# Altium project C210 Rev_B_220601.PrjPcb (part 4 of 5)

## Sheet C210_0004_MAX_Module_220601.SchDoc: C210_0004_MAX_Module
size B; Date: 2/26/2021; CompanyName: U-blox; DrawnBy: EMOO; Engineer: EMOO; Organization: U-blox; Address1: 2601 25th St. SE; Address2: Salem, OR 97302; SheetNumber: 4; SheetTotal: 7; Website: www.u-blox.com; SheetSize: B; SheetTitle: C-210 MAX Module
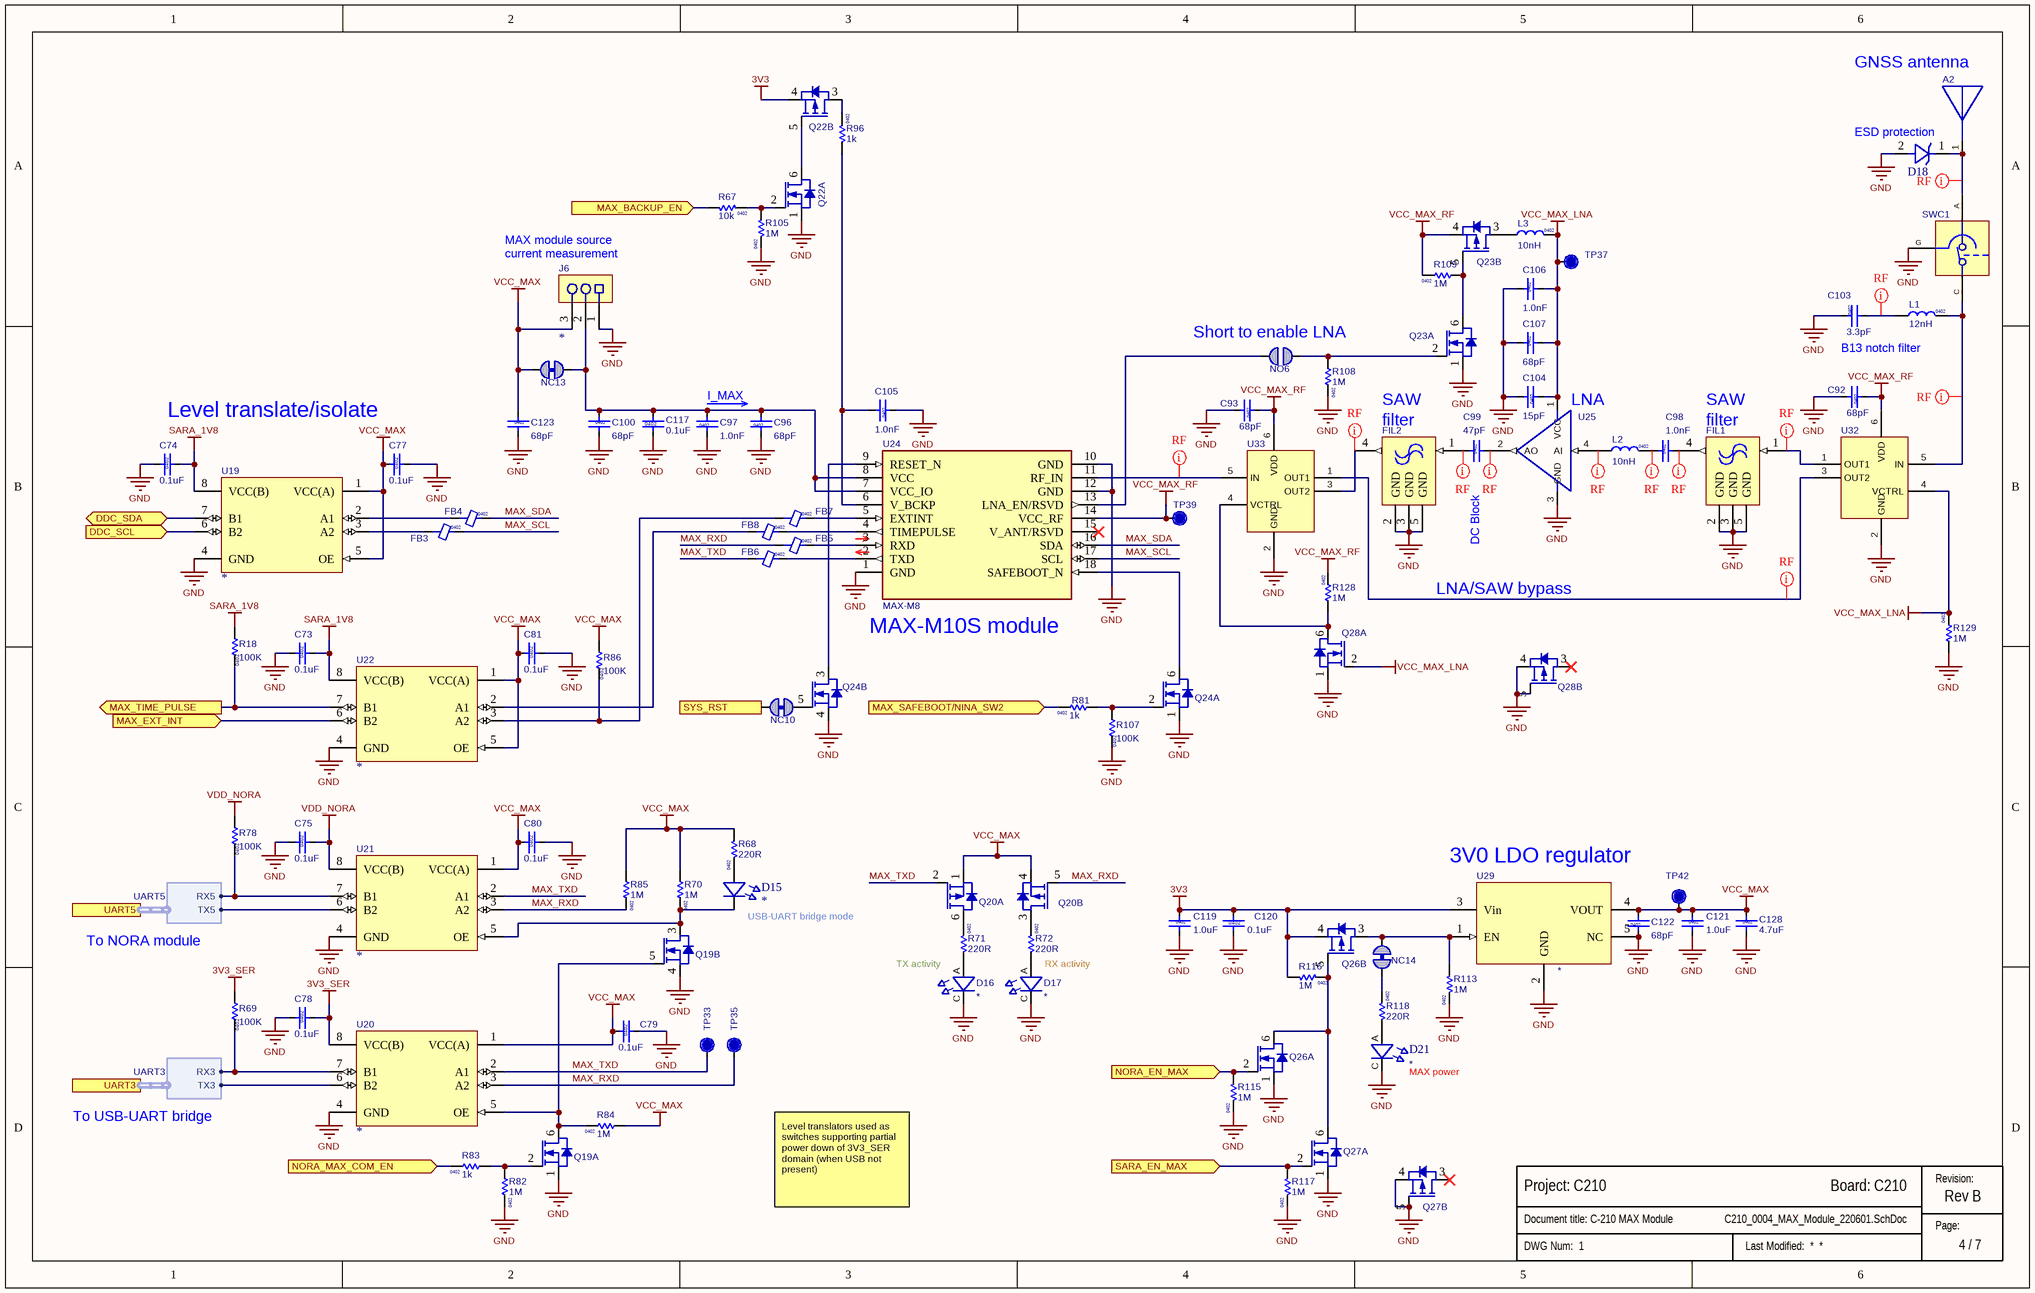
[diagram p6: C210_0004_MAX_Module_220601.SchDoc]

### Parts
(Parts that share a designator on the sheet are numbered #1, #2 ... from top to bottom, then left to right.)
?#8  (no value)  (graphical)
A2  CGGP.25.4.E.02  [CGGP.25.4.E.02]  (value not drawn)
C73  value 0.1uF  Size: 0402  [Cap 0402 HD]  (hidden comment: 120-000160.1uF)
C74  value 0.1uF  Size: 0402  [Cap 0402 HD]  (hidden comment: 120-000160.1uF)
C75  value 0.1uF  Size: 0402  [Cap 0402 HD]  (hidden comment: 120-000160.1uF)
C77  value 0.1uF  Size: 0402  [Cap 0402 HD]  (hidden comment: 120-000160.1uF)
C78  value 0.1uF  Size: 0402  [Cap 0402 HD]  (hidden comment: 120-000160.1uF)
C79  value 0.1uF  Size: 0402  [Cap 0402 HD]  (hidden comment: 120-000160.1uF)
C80  value 0.1uF  Size: 0402  [Cap 0402 HD]  (hidden comment: 120-000160.1uF)
C81  value 0.1uF  Size: 0402  [Cap 0402 HD]  (hidden comment: 120-000160.1uF)
C92  value 68pF  Size: 0402  [Cap 0402 HD]
C93  value 68pF  Size: 0402  [Cap 0402 HD]
C96  value 68pF  Size: 0402  [Cap 0402 HD]
C97  value 1.0nF  Size: 0402  [Cap 0402 HD]
C98  value 1.0nF  Size: 0402  [Cap 0402 HD]
C99  value 47pF  Size: 0402  [Cap 0402 HD]
C100  value 68pF  Size: 0402  [Cap 0402 HD]
C103  value 3.3pF  Size: 0402  [Cap 0402 HD]
C104  value 15pF  Size: 0402  [Cap 0402 HD]
C105  value 1.0nF  Size: 0402  [Cap 0402 HD]
C106  value 1.0nF  Size: 0402  [Cap 0402 HD]
C107  value 68pF  Size: 0402  [Cap 0402 HD]
C117  value 0.1uF  Size: 0402  [Cap 0402 HD]  (hidden comment: 120-000160.1uF)
C119  value 1.0uF  Size: 0402  [Cap 0402 HD]  (hidden comment: 120-000171.0uF)
C120  value 0.1uF  Size: 0402  [Cap 0402 HD]  (hidden comment: 120-000160.1uF)
C121  value 1.0uF  Size: 0402  [Cap 0402 HD]  (hidden comment: 120-000171.0uF)
C122  value 68pF  Size: 0402  [Cap 0402 HD]
C123  value 68pF  Size: 0402  [Cap 0402 HD]
C128  value 4.7uF  Size: 0402  [Cap 0402 HD]
D15  (no value)  [LED-0603]
D16  (no value)  [LTST-C190KGKT]
D17  (no value)  [LTST-C190YKT]
D18  (no value)  [SOD-923_2]
D21  (no value)  [LTST-C190EKT]
FB3  Size: 0402  [IND 0402]
FB4  Size: 0402  [IND 0402]
FB5  Size: 0402  [IND 0402]
FB6  Size: 0402  [IND 0402]
FB7  Size: 0402  [IND 0402]
FB8  Size: 0402  [IND 0402]
FIL1  (no value)  [QCS5P]
FIL2  (no value)  [QCS5P]
J6  (no value)  [HDR-0.1P-3Pin-1Row-SMT]
L1  value 12nH  Size: 0402  [IND 0402 HD]
L2  value 10nH  Size: 0402  [IND 0402]
L3  value 10nH  Size: 0402  [IND 0402]
NC10  Solderbridge-ShortDNP  [Solderbridge-Short]  (value not drawn)  (net tie, no BOM)
NC13  Solderbridge-ShortDNP  [Solderbridge-Short]  (value not drawn)  (net tie, no BOM)
NC14  Solderbridge-ShortDNP  [Solderbridge-Short]  (value not drawn)  (net tie, no BOM)
NO6  Solderbridge-OpenDNP  [Solderbridge-Open]  (value not drawn)  (no BOM)
Q19  (no value)  [SOT-563]  (parts A,B of 2)
Q20  (no value)  [FDY2000PZ]  (parts A,B of 2)
Q22  (no value)  [SOT-563]  (parts A,B of 2)
Q23  (no value)  [SOT-563]  (parts A,B of 2)
Q24  (no value)  [SOT-563]  (parts A,B of 2)
Q26  (no value)  [SOT-563]  (parts A,B of 2)
Q27  (no value)  [SOT-563]  (parts A,B of 2)
Q28  (no value)  [SOT-563]  (parts A,B of 2)
R18  value 100K  Size: 0402  [RES 0402 HD]
R67  value 10k  Size: 0402  [RES 0402 HD]
R68  value 220R  Size: 0402  [RES 0402 HD]
R69  value 100K  Size: 0402  [RES 0402 HD]
R70  value 1M  Size: 0402  [RES 0402 HD]
R71  value 220R  Size: 0402  [RES 0402 HD]
R72  value 220R  Size: 0402  [RES 0402 HD]
R78  value 100K  Size: 0402  [RES 0402 HD]
R81  value 1k  Size: 0402  [RES 0402 HD]
R82  value 1M  Size: 0402  [RES 0402 HD]
R83  value 1k  Size: 0402  [RES 0402 HD]
R84  value 1M  Size: 0402  [RES 0402 HD]
R85  value 1M  Size: 0402  [RES 0402 HD]
R86  value 100K  Size: 0402  [RES 0402 HD]
R96  value 1k  Size: 0402  [RES 0402 HD]
R105  value 1M  Size: 0402  [RES 0402 HD]
R107  value 100K  Size: 0402  [RES 0402 HD]
R108  value 1M  Size: 0402  [RES 0402 HD]
R109  value 1M  Size: 0402  [RES 0402 HD]
R113  value 1M  Size: 0402  [RES 0402 HD]
R115  value 1M  Size: 0402  [RES 0402 HD]
R116  value 1M  Size: 0402  [RES 0402 HD]
R117  value 1M  Size: 0402  [RES 0402 HD]
R118  value 220R  Size: 0402  [RES 0402 HD]
R128  value 1M  Size: 0402  [RES 0402 HD]
R129  value 1M  Size: 0402  [RES 0402 HD]
SWC1  (no value)  [MS-156C3]
TP33  TP  [TP12R]  (value not drawn)  (no BOM)
TP35  TP  [TP12R]  (value not drawn)  (no BOM)
TP37  TP  [TP12R]  (value not drawn)  (no BOM)
TP39  TP  [TP12R]  (value not drawn)  (no BOM)
TP42  TP  [TP12R]  (value not drawn)  (no BOM)
U19  (no value)  [QFN0.4P3x1-8Pin]
U20  (no value)  [QFN0.4P3x1-8Pin]
U21  (no value)  [QFN0.4P3x1-8Pin]
U22  (no value)  [QFN0.4P3x1-8Pin]
U24  MAX-M8  [MAX-M8]
U25  (no value)  [BGA0.4P2x2-4Pin]
U29  (no value)  [SOT-553]
U32  (no value)  [SKY13585-679LF]
U33  (no value)  [SKY13585-679LF]

### Ports
DDC_SCL (in), DDC_SDA (bidir), MAX_BACKUP_EN (in), MAX_EXT_INT (in), MAX_SAFEBOOT/NINA_SW2 (in), MAX_TIME_PULSE (out), NORA_EN_MAX (in), NORA_MAX_COM_EN (in), SARA_EN_MAX (in), SYS_RST (in), UART3 (harness UART3), UART5 (harness UART5)

### Harnesses
UART3: TX3, RX3
UART5: TX5, RX5

### Nets
3V3: C119.1 C120.1 Q22.4(S2) Q26.4(S2) R116.1 U29.3(Vin)
3V3_SER: C78.2 R69.1 U20.8(VCC(B))
GND: C73.1 C74.1 C75.1 C77.2 C78.1 C79.2 C80.2 C81.2 C92.2 C93.2 C96.1 C97.1 C100.2 C103.1 C104.2 C105.1 C106.1 C107.1 C117.1 C119.2 C120.2 C121.2 C122.1 C123.2 C128.2 D16.C(Cathode) D17.C(Cathode) D18.2 D21.C(Cathode) FIL1.2(GND) FIL1.3(GND) FIL1.5(GND) FIL2.2(GND) FIL2.3(GND) FIL2.5(GND) J6.1 Q19.1(S1) Q19.4(S2) Q22.1(S1) Q23.1(S1) Q24.1(S1) Q24.4(S2) Q26.1(S1) Q27.1(S1) Q27.4(S2) Q27.5(G2) Q28.1(S1) Q28.4(S2) Q28.5(G2) R82.2 R105.2 R107.2 R108.2 R113.2 R115.2 R117.2 R129.1 SWC1.G U19.4(GND) U20.4(GND) U21.4(GND) U22.4(GND) U24.1(GND) U24.10(GND) U24.12(GND) U25.3(GND) U29.2(GND) U29.5(NC) U32.2(GND) U33.2(GND)
SARA_1V8: C73.2 C74.2 R18.1 U19.8(VCC(B)) U22.8(VCC(B))
VCC_MAX: C77.1 C79.1 C80.1 C81.1 C121.1 C122.2 C123.1 C128.1 J6.3 NC13.2 Q20.1(S1) Q20.4(S2) R68.1 R70.1 R84.1 R85.1 R86.1 TP42.1 U19.1(VCC(A)) U19.5(OE) U20.1(VCC(A)) U21.1(VCC(A)) U22.1(VCC(A)) U22.5(OE) U29.4(VOUT)
VCC_MAX_LNA: C104.1 C106.2 C107.2 L3.2 Q28.2(G1) R129.2 TP37.1 U25.1(VCC) U32.4(VCTRL)
VCC_MAX_RF: C92.1 C93.1 Q23.4(S2) R109.2 R128.2 TP39.1 U24.14(VCC_RF) U32.6(VDD) U33.6(VDD)
VDD_NORA: C75.2 R78.1 U21.8(VCC(B))
MAX_RXD: FB5.1 Q20.5(G2) R85.2 TP35.1 U20.3(A2) U21.3(A2)
MAX_SCL: FB3.2 U24.17(SCL)
MAX_SDA: FB4.2 U24.16(SDA)
MAX_TXD: FB6.1 Q20.2(G1) TP33.1 U20.2(A1) U21.2(A1)
RX5: R78.2 U21.7(B1) ; port UART5.RX5
SYS_RST: NC10.2 ; port SYS_RST
TX5: U21.6(B2) ; port UART5.TX5
NetA2_1: A2.1 D18.1 SWC1.A
NetC96_2: C96.2 C97.2 C100.1 C117.2 J6.2 NC13.1 U24.7(VCC_IO) U24.8(VCC)
NetC98_1: C98.1 L2.2
NetC98_2: C98.2 FIL1.4(Output)
NetC99_1: C99.1 FIL2.1(Input)
NetC99_2: C99.2 U25.2(AO)
NetC103_2: C103.2 L1.1
NetC105_2: C105.2 R96.1 U24.6(V_BCKP)
NetD15_1: D15.1(C) Q19.3(D2) R70.2 U21.5(OE)
NetD15_2: D15.2(A) R68.2
NetD16_A: D16.A(Anode) R71.1
NetD17_A: D17.A(Anode) R72.1
NetD21_A: D21.A(Anode) R118.1
NetFB3_1: FB3.1 U19.3(A2)
NetFB4_1: FB4.1 U19.2(A1)
NetFB5_2: FB5.2 U24.3(RXD)
NetFB6_2: FB6.2 U24.2(TXD)
NetFB7_1: FB7.1 R86.2 U22.3(A2)
NetFB7_2: FB7.2 U24.5(EXTINT)
NetFB8_1: FB8.1 U22.2(A1)
NetFB8_2: FB8.2 U24.4(TIMEPULSE)
NetFIL1_1: FIL1.1(Input) U32.1(OUT1)
NetFIL2_4: FIL2.4(Output) U33.3(OUT2)
NetL1_2: L1.2 SWC1.C U32.5(IN)
NetL2_1: L2.1 U25.4(AI)
NetL3_1: L3.1 Q23.3(D2)
NetNC10_1: NC10.1 Q24.5(G2)
NetNC14_1: NC14.1 Q26.3(D2) R113.1 U29.1(EN)
NetNC14_2: NC14.2 R118.2
NetNO6_1: NO6.1 U24.13(LNA_EN/RSVD)
NetNO6_2: NO6.2 Q23.2(G1) R108.1
NetQ1_5: R81.2 ; port MAX_SAFEBOOT/NINA_SW2
NetQ19_2: Q19.2(G1) R82.1 R83.1
NetQ19_5: Q19.5(G2) Q19.6(D1) R84.2 U20.5(OE)
NetQ20_3: Q20.3(D2) R72.2
NetQ20_6: Q20.6(D1) R71.2
NetQ22_2: Q22.2(G1) R67.2 R105.1
NetQ22_3: Q22.3(D2) R96.2
NetQ22_5: Q22.5(G2) Q22.6(D1)
NetQ23_5: Q23.5(G2) Q23.6(D1) R109.1
NetQ24_2: Q24.2(G1) R81.1 R107.1
NetQ24_3: Q24.3(D2) U24.9(RESET_N)
NetQ24_6: Q24.6(D1) U24.18(SAFEBOOT_N)
NetQ26_2: Q26.2(G1) R115.1 ; port NORA_EN_MAX
NetQ26_5: Q26.5(G2) Q26.6(D1) Q27.6(D1) R116.2
NetQ27_2: Q27.2(G1) R117.1 ; port SARA_EN_MAX
NetQ28_6: Q28.6(D1) R128.1 U33.4(VCTRL)
NetR18_2: R18.2 U22.7(B1) ; port MAX_TIME_PULSE
NetR67_1: R67.1 ; port MAX_BACKUP_EN
NetR69_2: R69.2 U20.7(B1) ; port UART3.RX3
NetR83_2: R83.2 ; port NORA_MAX_COM_EN
NetTP13_1: U19.7(B1) ; port DDC_SDA
NetTP14_1: U19.6(B2) ; port DDC_SCL
NetU1_25: U22.6(B2) ; port MAX_EXT_INT
NetU6_4: U20.6(B2) ; port UART3.TX3
NetU24_11: U24.11(RF_IN) U33.5(IN)
NetU32_3: U32.3(OUT2) U33.1(OUT1)

Not connected (* = marked no-connect by the designer): Q27 3(D2)*; Q28 3(D2)*; U24 15(V_ANT/RSVD)*

### Layout directives
net class RF: NetA2_1, NetC98_1, NetC98_2, NetC99_1, NetC99_2, NetC103_2, NetFIL1_1, NetFIL2_4, NetL1_2, NetL2_1, NetU24_11, NetU32_3

### Notes on the sheet
- GNSS antenna
- ESD protection
- MAX module source
- (near J6) current measurement
- (near NO6) Short to enable LNA
- B13 notch filter
- Level translate/isolate
- (near C97) I_MAX
- SAW
- (near FIL2) filter
- (near U25) LNA
- (near FIL1) filter
- DC Block
- MAX-M10S module
- LNA/SAW bypass
- 3V0 LDO regulator
- To NORA module
- (near D15) USB-UART bridge mode
- TX activity
- RX activity
- (near D21) MAX power
- To USB-UART bridge
- Level translators used as switches supporting partial power down of 3V3_SER domain (when USB not present)
- Revision:
- Page:

### Library data of the parts
?#8 = Sub_Title_Block: as ?#6 on sheet C210_0007_Sensors_220601
A2 = CGGP.25.4.E.02: ANT, THROUGH-HOLE, PATCH, GNSS, BEIDOU, GLONASS, GPS, 5dBi, 25MMx35MMx4MM; Manufacturer 1: Taoglas; Body Size: 25mm x 25mm; Item Phase: Unreleased; MFG Package: Custom; Use in new designs: Yes; UBX Code: None; Part Number: CGGP.25.4.E.02; Manufacturer Part Number 1: CGGP.25.4.E.02; Supplier 1: Digi-key; Supplier Part Number 1: 931-1472-ND; Height: 4mm; Max Operating Temp: 125; Min Operating Temp: -55; Pins: 1; Revision: None; Size: Other; SMT Pitch: N/A; Voltage: N/A; Manufacturer 2: None; Manufacturer Part Number 2: None; Supplier 2: None; Supplier Part Number 2: None
C73-C75 C77-C81 C117 C120 = 120-00016: as C71 on sheet C210_0007_Sensors_220601; Part Number: 120-00016; Revision: 0A; Supplier 1: Digi-Key; Supplier Part Number 1: 490-6297-1-ND; Manufacturer 2: Yageo; Manufacturer P/N 2: CC0402KRX5R6BB104; Supplier 2: Digi-Key; Supplier Part Number 2: 311-1336-1-ND; Arena Link: https://app.bom.com/a/GYHPV2L2L43KRMBK?v=spec.summary; Height: 0.55mm; Pins: 2; Temperature Coefficient: X5R; Voltage: 10V
C92 C93 C96 C100 C107 C122 C123 = 120-00047: as C138-C140 on sheet C210_0007_Sensors_220601; Part Number: 120-00047; Supplier 1: Digi-Key; Supplier Part Number 1: 490-8219-1-ND; Manufacturer 2: AVX Corporation; Manufacturer Part Number 2: 04025A680FAT2A; Supplier 2: Digi-Key; Supplier Part Number 2: 478-7881-1-ND; Height: 0.55mm; Max Operating Temp: 125; Min Operating Temp: -55; Pins: 2; Revision: None; Temperature Coefficient: NP0; Voltage: 50V
C97 C98 C105 C106 = 120-00010: CAP CER 1.0nF 50V 10% X7R 0402; Manufacturer 1: TDK Corporation; Manufacturer Part Number 1: C1005X7R1H102K050BE; Item Phase: In Production; Tolerance: +/- 10%; Use in new designs: Yes; UBX Code: None; Part Number: 120-00010; Supplier 1: Digi-Key; Supplier Part Number 1: 445-173622-1-ND; Manufacturer 2: Kemet; Manufacturer Part Number 2: C0402C102K5RACTU; Supplier 2: Digi-Key; Supplier Part Number 2: 399-1032-1-ND; Height: 0.55mm; Max Operating Temp: 125; Min Operating Temp: -55; Part Name: CAP CER 1.0NF 50V 10% X7R 0402; Pins: 2; Revision: 0D; Temperature Coefficient: X7R; Voltage: 50V
C99 = 120-00081: Cap, Ceramic 47pF 50V 5% NP0 0402; Manufacturer 1: Murata Electronics North America; Manufacturer Part Number 1: GRM1555C1H470JA01D; Part Name: CAP CER 47PF 50V 5% NP0 0402; Item Phase: In Production; Tolerance: +/- 5%; Use in new designs: Yes; UBX Code: None; Part Number: 120-00081; Supplier 1: Digi-Key; Supplier Part Number 1: 490-5942-1-ND; Manufacturer 2: Samsung Electro-Mechanics America, Inc; Manufacturer Part Number 2: CL05C470JB5NNNC; Supplier 2: Digi-Key; Supplier Part Number 2: 1276-1699-1-ND; Height: 0.55mm; Max Operating Temp: 125; Min Operating Temp: -55; Pins: 2; Revision: 0A; Temperature Coefficient: NP0; Voltage: 50V
C103 = 120-00079: CAP CER 3.3PF 50V +/-0.25pF NP0 0402; Manufacturer 1: Murata Electronics North America; Manufacturer Part Number 1: GRM1555C1H3R3CA01D; Item Phase: In Production; Tolerance: Other; Use in new designs: Yes; UBX Code: None; Part Number: 120-00079; Supplier 1: Digi-Key; Supplier Part Number 1: 490-5938-1-ND; Manufacturer 2: Samsung Electro-Mechanics America, Inc; Manufacturer Part Number 2: CL05C3R3CB5NNNC; Supplier 2: Digi-Key; Supplier Part Number 2: 1276-1141-1-ND; Height: 0.55mm; Max Operating Temp: 125; Min Operating Temp: -55; Part Name: CAP CER 3.3PF 50V +/-0.25pF NP0 0402; Pins: 2; Revision: 0A; Temperature Coefficient: NP0; Voltage: 50V
C104 = 120-00110: Capacitor, Ceramic, 15pF 5%, 50V, NPO, 0402; Manufacturer 1: Murata Electronics North America; Manufacturer Part Number 1: GRM1555C1H150JA01D; Part Name: CAP CER 15pF 50V 5% NP0 0402; Item Phase: In Production; Temperature Coefficient: NP0; Tolerance: +/- 5%; Use in new designs: Yes; UBX Code: None; Part Number: 120-00110; Supplier 1: Digi-Key; Supplier Part Number 1: 490-5888-1-ND; Manufacturer 2: None; Manufacturer Part Number 2: None; Supplier 2: None; Supplier Part Number 2: None; Height: 0.55mm; Max Operating Temp: 125; Min Operating Temp: -55; Pins: 2; Revision: 0A; Voltage: 50V
C119 C121 = 120-00017: as C32 on sheet C210_0001_Serial_Interface_220601; Part Number: 120-00017; Revision: 0A; Supplier 1: Digi-Key; Supplier Part Number 1: 490-3890-1-ND; Manufacturer 2: TDK Corporation; Manufacturer P/N 2: C1005X5R1A105K050BB; Supplier 2: Digi-Key; Supplier Part Number 2: 445-4114-1-ND; Arena Link: https://app.bom.com/a/1J2AGN6N6PO5C7V9?v=spec.summary; Height: 0.55mm; Pins: 2; Temperature Coefficient: X5R; Voltage: 10V
C128 = 120-00020: as C109 on sheet C210_0007_Sensors_220601; Part Number: 120-00020; Supplier 1: Digi-Key; Supplier Part Number 1: 1276-1482-1-ND; Manufacturer 2: Yageo; Manufacturer Part Number 2: CC0402KRX5R6BB475; Supplier 2: Digi-Key; Supplier Part Number 2: 311-3477-1-ND; Height: 0.55mm; Max Operating Temp: 85; Min Operating Temp: -55; Pins: 2; Revision: 0C; Temperature Coefficient: X5R; Voltage: 10V
D15 = 115-00023: LED BLUE DIFFUSED 0603 SMD; Manufacturer 1: OSRAM Opto Semiconductors Inc; Manufacturer Part Number 1: LB Q39G-L2OO-35-1; Body Size: None; Item Phase: Unreleased; Color: *; Part Number: 115-00023; Supplier 1: Digi-Key; Supplier Part Number 1: 475-2816-1-ND; Current: None; Height: None; MFG Package: None; Max Operating Temp: None; Min Operating Temp: None; Part Name: LED BLUE DIFFUSED 0603 SMD; Pins: None; Revision: None; Size: None; Use in new designs: None; Voltage: None; UBX Code: None; Manufacturer 2: None; Manufacturer Part Number 2: None; Supplier 2: None; Supplier Part Number 2: None
D16 = LTST-C190KGKT: DIODE, LED, SMT, GREEN, CLEAR LENS, 2.0V 20mA, 0603; Part Number: 115-00019; Manufacturer 1: Lite-On Inc; Part Name: LED Green SMT 0603; Body Size: 1.60mm x 0.80mm; Item Phase: In Production; MFG Package: None; Use in new designs: Yes; Manufacturer Part Number 1: LTST-C190KGKT; Supplier 1: Digi-Key; Supplier Part Number 1: 160-1435-2-ND; Current: 20mA; Height: 0.80mm; Max Operating Temp: 85; Min Operating Temp: -30; Pins: 2; Revision: 0A; Size: 0603; Voltage: 2.0V; UBX Code: None; Manufacturer 2: None; Manufacturer Part Number 2: None; Supplier 2: None; Supplier Part Number 2: None; Color: *
D17 = LTST-C190YKT: DIODE, LED, SMT, YELLOW, CLEAR LENS, 2.1V 10mA, 0603; Manufacturer 1: Lite-On Inc; Part Name: LED Yellow SMT 0603; Body Size: 1.60mm x 0.80mm; Item Phase: In Production; MFG Package: None; Use in new designs: Yes; Part Number: LTST-C190YKT; Manufacturer Part Number 1: LTST-C190YKT; Supplier 1: Digi-Key; Supplier Part Number 1: 160-1184-2-ND; Current: 10mA; Height: 0.80mm; Max Operating Temp: 85; Min Operating Temp: -30; Pins: 2; Revision: 0A; Size: 0603; Voltage: 2.1V; UBX Code: None; Manufacturer 2: None; Manufacturer Part Number 2: None; Supplier 2: None; Supplier Part Number 2: None; Color: *
D18 = ESD9101P2T5G: Diode, TVS, SMT, ESD9101P2T5G, 3.3V, 0.5pF, SOD-923; Manufacturer 1: ON Semiconductor; Part Name: Diode TVS 3.3V SOD-923; Body Size: 0.8mm x 0.6mm; Current: None; Item Phase: In Production; Use in new designs: Yes; Manufacturer Part Number 1: ESD9101P2T5G; Height: 0.4mm; MFG Package: SOD-923; Max Operating Temp: 150; Min Operating Temp: -55; Pins: 2; Revision: 0A; Voltage: 3.3V; UBX Code: None
D21 = LTST-C190EKT: DIODE, LED, SMT, Red, CLEAR LENS, 2.0V 10mA, 0603; Manufacturer 1: Lite-On Inc; Part Name: LED Red SMT 0603; Body Size: 1.60mm x 0.80mm; Item Phase: In Production; MFG Package: None; Use in new designs: Yes; Part Number: LTST-C190EKT; Manufacturer Part Number 1: LTST-C190EKT; Supplier 1: Digi-Key; Supplier Part Number 1: 160-1182-2-ND; Current: 10mA; Height: 0.80mm; Max Operating Temp: 85; Min Operating Temp: -30; Pins: 2; Revision: 0A; Size: 0603; Voltage: 2.0V; UBX Code: None; Manufacturer 2: None; Manufacturer Part Number 2: None; Supplier 2: None; Supplier Part Number 2: None; Color: *
FB3-FB8 = 155-00003: Ferrite Bead, 1k Ohm @ 100MHz, 0402; Manufacturer 1: Taiyo Yuden; Manufacturer Part Number 1: BK1005HM102-T; Part Name: FERRITE BEAD 1K OHM 0402; Body Size: None; Current: 150mA; Item Phase: In Production; Use in new designs: Yes; Value: None; Part Number: 155-00003; Supplier 1: Digi-Key; Supplier Part Number 1: 587-1835-1-ND; Height: 0.55mm; MFG Package: None; Max Operating Temp: 125; Min Operating Temp: -55; Pins: 2; Revision: 0A; Voltage: None; Manufacturer 2: Kemet; Manufacturer Part Number 2: Z0402C102BSMST; Supplier 2: Digi-Key; Supplier Part Number 2: 399-9602-1-ND; UBX Code: None
FIL1 FIL2 = B39162B4353P810: FILTER, SMT, SAW, GNSS, 1.559-1.606GHz, LGA5; Manufacturer 1: RF360; Body Size: 1.4mm x 1.1mm; Current: None; Item Phase: In Production; Use in new designs: Yes; Part Number: B39162B4353P810; Manufacturer Part Number 1: B39162B4353P810; Supplier 1: Mouser; Supplier Part Number 1: 871-B39162B4353P810; Height: 0.45mm; MFG Package: QCS5P; Max Operating Temp: 85; Min Operating Temp: -40; Part Name: B39162B4353P810; Pins: 5; Revision: 0A; Voltage: N/A; UBX Code: None
J6 = 130-00105: Header, 0.100" Pitch, 3 Pin, Vertical SMT, Black; Manufacturer 1: Harwin Inc; Manufacturer Part Number 1: M20-8770342; Part Name: CON HDR 0.1" 3 Pin 1 Row SMT; Item Phase: In Production; Use in new designs: Yes; Voltage: None; Manufacturer P/N: *; Part Number: 130-00105; Supplier 1: Digi-Key; Supplier Part Number 1: 952-1951-ND; Diameter: None; Height: 9.93mm; Max Operating Temp: None; Min Operating Temp: None; Pins: 3; Revision: 0C; UBX Code: None; Manufacturer 2: Greenconn Corporation; Manufacturer Part Number 2: GPHC1010302A081B1BD; Supplier 2: Teamwise Limited; Supplier Part Number 2: Greenconn Corporation GPHC1010302A081B1BD
L1 = 150-00028: Inductor, 12nH, 300mA, 0402; Manufacturer 1: Johanson Technology Inc.; Manufacturer Part Number 1: L-07C12NJV6T; Part Name: IND 12nH 250mA 0402; Body Size: None; Item Phase: Unreleased; Tolerance: +/- 5%; Use in new designs: Yes; Part Number: 150-00028; Supplier 1: Digi-Key; Supplier Part Number 1: 712-1453-1-ND; Current: 300mA; Height: 0.6mm; Isat: None; Max Operating Temp: 125; Min Operating Temp: -55; Pins: 2; Revision: None; Voltage: N/A; UBX Code: None; Manufacturer 2: None; Manufacturer Part Number 2: None; Supplier 2: None; Supplier Part Number 2: None
L2 L3 = 150-00010: INDUCTOR 10NH 300MA 0402; Manufacturer 1: Murata Electronics North America; Manufacturer Part Number 1: LQG15HS10NJ02D; Body Size: None; Item Phase: In Production; Tolerance: +/- 5%; Use in new designs: Yes; Part Number: 150-00010; Supplier 1: Digi-Key; Supplier Part Number 1: 490-2623-1-ND; Current: None; Height: 0.55mm; Isat: 300mA; Max Operating Temp: 125; Min Operating Temp: -55; Part Name: INDUCTOR 10NH 300MA 0402; Pins: 2; Revision: 0A; Voltage: None; UBX Code: None; Manufacturer 2: None; Manufacturer Part Number 2: None; Supplier 2: None; Supplier Part Number 2: None
NC10 NC13 NC14 = Solderbridge-Short: Added By: Paul B; Part Number: Solderbridge-Short; Height: 0; DNP: DNP; Added Date: 12/2/2015
NO6 = Solderbridge-Open: Added By: Paul B; Part Number: Solderbridge-Open; Height: 0; DNP: DNP; Added Date: 12/2/2015
Q19 Q24 = 140-00016: as Q14 on sheet C210_0001_Serial_Interface_220601; Part Number: 140-00016; Supplier 1: Digi-Key; Supplier Part Number 1: SSM6N56FELMCT-ND; Height: 0.6mm; MFG Package: SOT-563; Max Operating Temp: 150; Min Operating Temp: -55; Pins: 6; Revision: 0A; Voltage: 20V; Manufacturer 2: None; Manufacturer Part Number 2: None; Supplier 2: None; Supplier Part Number 2: None
Q20 = FDY2000PZ: MOSFET DUAL P-CH 20V SOT-563, -350mA; Manufacturer 1: ON Semiconductor; Body Size: 1.6mmx1.6mm; Item Phase: In Production; Transistor Type: Multiple; Thermal Pad: No; Use in new designs: Yes; UBX Code: None; Part Number: FDY2000PZ; Manufacturer Part Number 1: FDY2000PZ; Supplier 1: Digi-Key; Supplier Part Number 1: 2156-FDY2000PZ-ND; Current: -350mA; Height: 0.6mm; MFG Package: SOT-563; Max Operating Temp: 150; Min Operating Temp: -55; Part Name: MOSFET DUAL P-CH 20V SOT-563; Pins: 6; Revision: 0A; Voltage: 20V; Manufacturer 2: None; Manufacturer Part Number 2: None; Supplier 2: None; Supplier Part Number 2: None
Q22 Q23 Q26-Q28 = 140-00030: MOSFET N/P-CH 20V SOT-563, 540 mA, −430 mA; Manufacturer 1: ON Semiconductor; Manufacturer Part Number 1: NTZD3155CT2G; Body Size: 1.6mmx1.6mm; Transistor Type: Multiple; Use in new designs: Yes; Item Phase: In Production; Thermal Pad: No; UBX Code: None; Part Number: 140-00030; Part Name: MOSFET N/P-CH 20V SOT-563; Supplier 1: Digi-Key; Supplier Part Number 1: NTZD3155CT2GOSCT-ND; Current: 540 mA, −430 mA; Height: 0.6mm; MFG Package: SOT-563; Pins: 6; Voltage: 20V; Max Operating Temp: 150; Min Operating Temp: -55; Revision: 0A; Manufacturer 2: None; Manufacturer Part Number 2: None; Supplier 2: None; Supplier Part Number 2: None
R18 R69 R78 R86 R107 = 180-00093: as R57 on sheet C210_0007_Sensors_220601; Part Number: 180-00093; Supplier 1: Digi-Key; Supplier Part Number 1: 311-100KLRCT-ND; Manufacturer 2: Rohm Semiconductor; Manufacturer Part Number 2: MCR01MRTF1003; Supplier 2: Digi-Key; Supplier Part Number 2: RHM100KCDCT-ND; Height: 0.4mm; Max Operating Temp: 155; Min Operating Temp: -55; Pins: 2; Power: 1/16W; Revision: 0B; UBX Code: None
R67 = 180-00024: as R77 on sheet C210_0007_Sensors_220601; Part Number: 180-00024; Supplier 1: Digi-Key; Supplier Part Number 1: 1276-3431-1-ND; Manufacturer 2: Hong Kong Resistors Manufactory; Manufacturer Part Number 2: RCT0210KFLF; Supplier 2: None; Supplier Part Number 2: None; Height: 0.4mm; Max Operating Temp: 155; Min Operating Temp: -55; Pins: 2; Power: 1/16W; Revision: 0E; Voltage: N/A
R68 R71 R72 R118 = 180-00098: Resistor, 220ohm, 5%, 1/16W, 0402.; Part Name: RES SMD 220 OHM 5% 1/16W 0402; Manufacturer: Panasonic Electronic Components; Manufacturer P/N: ERJ-2GEJ221X; Item_Phase: Production; Component Mounting Type: SMT; Tolerance: +/- 5%; Use in new designs: Yes; Part Number: 180-00098; Part_Type: Resistor; Supplier 1: Digi-Key; Supplier Part Number 1: P220JCT-ND; Arena Link: https://app.bom.com/a/8Q9HNUDUDWVBJC30?v=spec.summary; Pins: 2; Power: 1/16W; Revision: 0C; Manufacturer 2: Samsung Electro-Mechanics America, Inc; Manufacturer P/N 2: RC1005J221CS; Supplier 2: Digi-Key; Supplier Part Number 2: 1276-4360-1-ND; Alternate Footprint Ref: RES 0402; Height: 0.4mm
R70 R82 R84 R85 R105 R108 R109 R113 R115-R117 R128 R129 = 180-00054: as R90 on sheet C210_0001_Serial_Interface_220601; Part Number: 180-00054; Supplier 1: Digi-Key; Supplier Part Number 1: 1276-3433-1-ND; Manufacturer 2: Hong Kong Resistors Manufactory; Manufacturer Part Number 2: RCT021MFLF; Supplier 2: None; Supplier Part Number 2: None; Height: 0.4mm; Max Operating Temp: 155; Min Operating Temp: -55; Pins: 2; Power: 1/16W; Revision: 0D; UBX Code: None
R81 R83 R96 = 180-00021: Resistor 1k ohm 1% 1/16W, 0402; Manufacturer 1: Hong Kong Resistors Manufactory; Manufacturer Part Number 1: RCT021KFLF; Part Name: RES SMD 1K OHM 1% 1/16W 0402; Item Phase: In Production; Tolerance: +/- 1%; Use in new designs: Yes; Voltage: None; Part Number: 180-00021; Supplier 1: None; Supplier Part Number 1: None; Manufacturer 2: Yageo; Manufacturer Part Number 2: RC0402FR-071KL; Supplier 2: Digi-Key; Supplier Part Number 2: 311-1.00KLRCT-ND; Height: 0.4mm; Max Operating Temp: 155; Min Operating Temp: -55; Pins: 2; Power: 1/16W; Revision: 0E; UBX Code: None
SWC1 = MS-156C3: Conn, Coax, Test, Switch, 50Ohm, SMT, 2.5mmX2.4mm; Manufacturer 1: Hirose; Part Name: CON HDR 0.1" 3 Pin 1 Row SMT R/A; Item Phase: In Production; Use in new designs: Yes; Voltage: None; Part Number: MS-156C3; Manufacturer Part Number 1: MS-156C3; Supplier 1: None; Supplier Part Number 1: None; Diameter: None; Height: 3.05mm; Max Operating Temp: None; Min Operating Temp: None; Pins: 3; Revision: 0A; UBX Code: None; Manufacturer 2: None; Manufacturer Part Number 2: None; Supplier 2: None; Supplier Part Number 2: None; Manufacturer P/N: *
TP33 TP35 TP37 TP39 TP42 = TP_R: as TP32 on sheet C210_0007_Sensors_220601; Size: 1.0mm; Height: 0; DNP: DNP; Added Date: 2/1/2015; Checked By: Paul B; Checked Date: 2/5/2015
U19-U22 = 225-00008: IC Dual Translating Transceiver, 8XQFN; Manufacturer 1: NXP Semiconductors; Part Name: IC TXRX TRANSLATING 8XQFN; Body Size: 1.4mm X 1.2mm; Item Phase: In Production; Logic Type: Level Translator; MFG Package: 8-XFQFN; SMT Pitch: 0.4mm; Thermal Pad: No; Use in new designs: Yes; Voltage: 5.5V; UBX Code: None; Manufacturer P/N: *; Part Number: 225-00008; Manufacturer Part Number 1: NTSX2102GU8H; Supplier 1: Digi-Key; Supplier Part Number 1: 568-10216-2-ND; Height: 0.5mm; Max Operating Temp: 85; Min Operating Temp: -40; Pins: 8; Revision: 0A; Manufacturer 2: None; Manufacturer Part Number 2: None; Supplier 2: None; Supplier Part Number 2: None
U24 = MAX: u-blox MAX GNSS module; Part Description: u-blox GNSS module; Manufacturer: u-blox; Value: MAX-M8
U25 = BGA123L4: LNA, SMT, GNSS, 1.1-3.6V, 1.1mA18dB, 0.75dB, BGA4; Manufacturer 1: Infineon Technologies; Manufacturer Part Number 1: BGA123L4E6327XTSA1; Body Size: 0.7mm x 0.7mm; Current: None; Item Phase: In Production; MFG Package: TSLP-4-11; Use in new designs: Yes; Part Number: BGA123L4; Supplier 1: Digi-Key; Supplier Part Number 1: BGA123L4E6327XTSA1TR-ND; Height: 0.35mm; Max Operating Temp: 85; Min Operating Temp: -40; Part Name: BGA123L4; Pins: 4; Revision: 0A; Voltage: 1.1-3.6V; UBX Code: None
U29 = 260-00027: LDO, 3.0V, 200mA, SOT-5; Manufacturer 1: Toshiba Semiconductor and Storage; Manufacturer Part Number 1: TCR2LE30,LM(CT; Part Name: TCR2LE30; Body Size: 2.9mm x 1.6mm; Item Phase: Unreleased; Reg Outputs: 1xLDO; SMT Pitch: None; Thermal Pad: No; Use in new designs: Yes; Voltage: 6.0V; Manufacturer P/N: *; Part Number: 260-00027; Supplier 1: Digi-Key; Supplier Part Number 1: TCR2LE30LM(CTCT-ND; Current: 200mA; Height: 1.3mm; MFG Package: SOT-553; Max Operating Temp: 85; Min Operating Temp: -40; Pins: 5; Revision: None; UBX Code: None; Manufacturer 2: None; Manufacturer Part Number 2: None; Supplier 2: None; Supplier Part Number 2: None
U32 U33 = SKY13585-679LF:: RF SWITCH, SPDT, I2C, 3-AXIS, 3-5V, 1-6GHz, SMT, DFN-6, 1mmX1mm; Manufacturer 1: ST Micro; Part Name: LIS3MDL; Body Size: 2mm x 2mm; Current: None; Item Phase: In Production; MFG Package: LGA-12; Use in new designs: Yes; Voltage: 1.9-3.6V; Part Number: SKY13585-679LF:; Manufacturer Part Number 1: SKY13585-679LF:; Height: 1mm; Max Operating Temp: 85; Min Operating Temp: -40; Pins: 12; Revision: 0A; UBX Code: None

## Sheet C210_0005_NINA_Module_220601.SchDoc: C210_0005_NINA_Module
size B; Date: 2/26/2021; CompanyName: U-blox; DrawnBy: EMOO; Engineer: EMOO; Organization: U-blox; Address1: 2601 25th St. SE; Address2: Salem, OR 97302; SheetNumber: 5; SheetTotal: 7; Website: www.u-blox.com; SheetSize: B; SheetTitle: C-210NINA Module
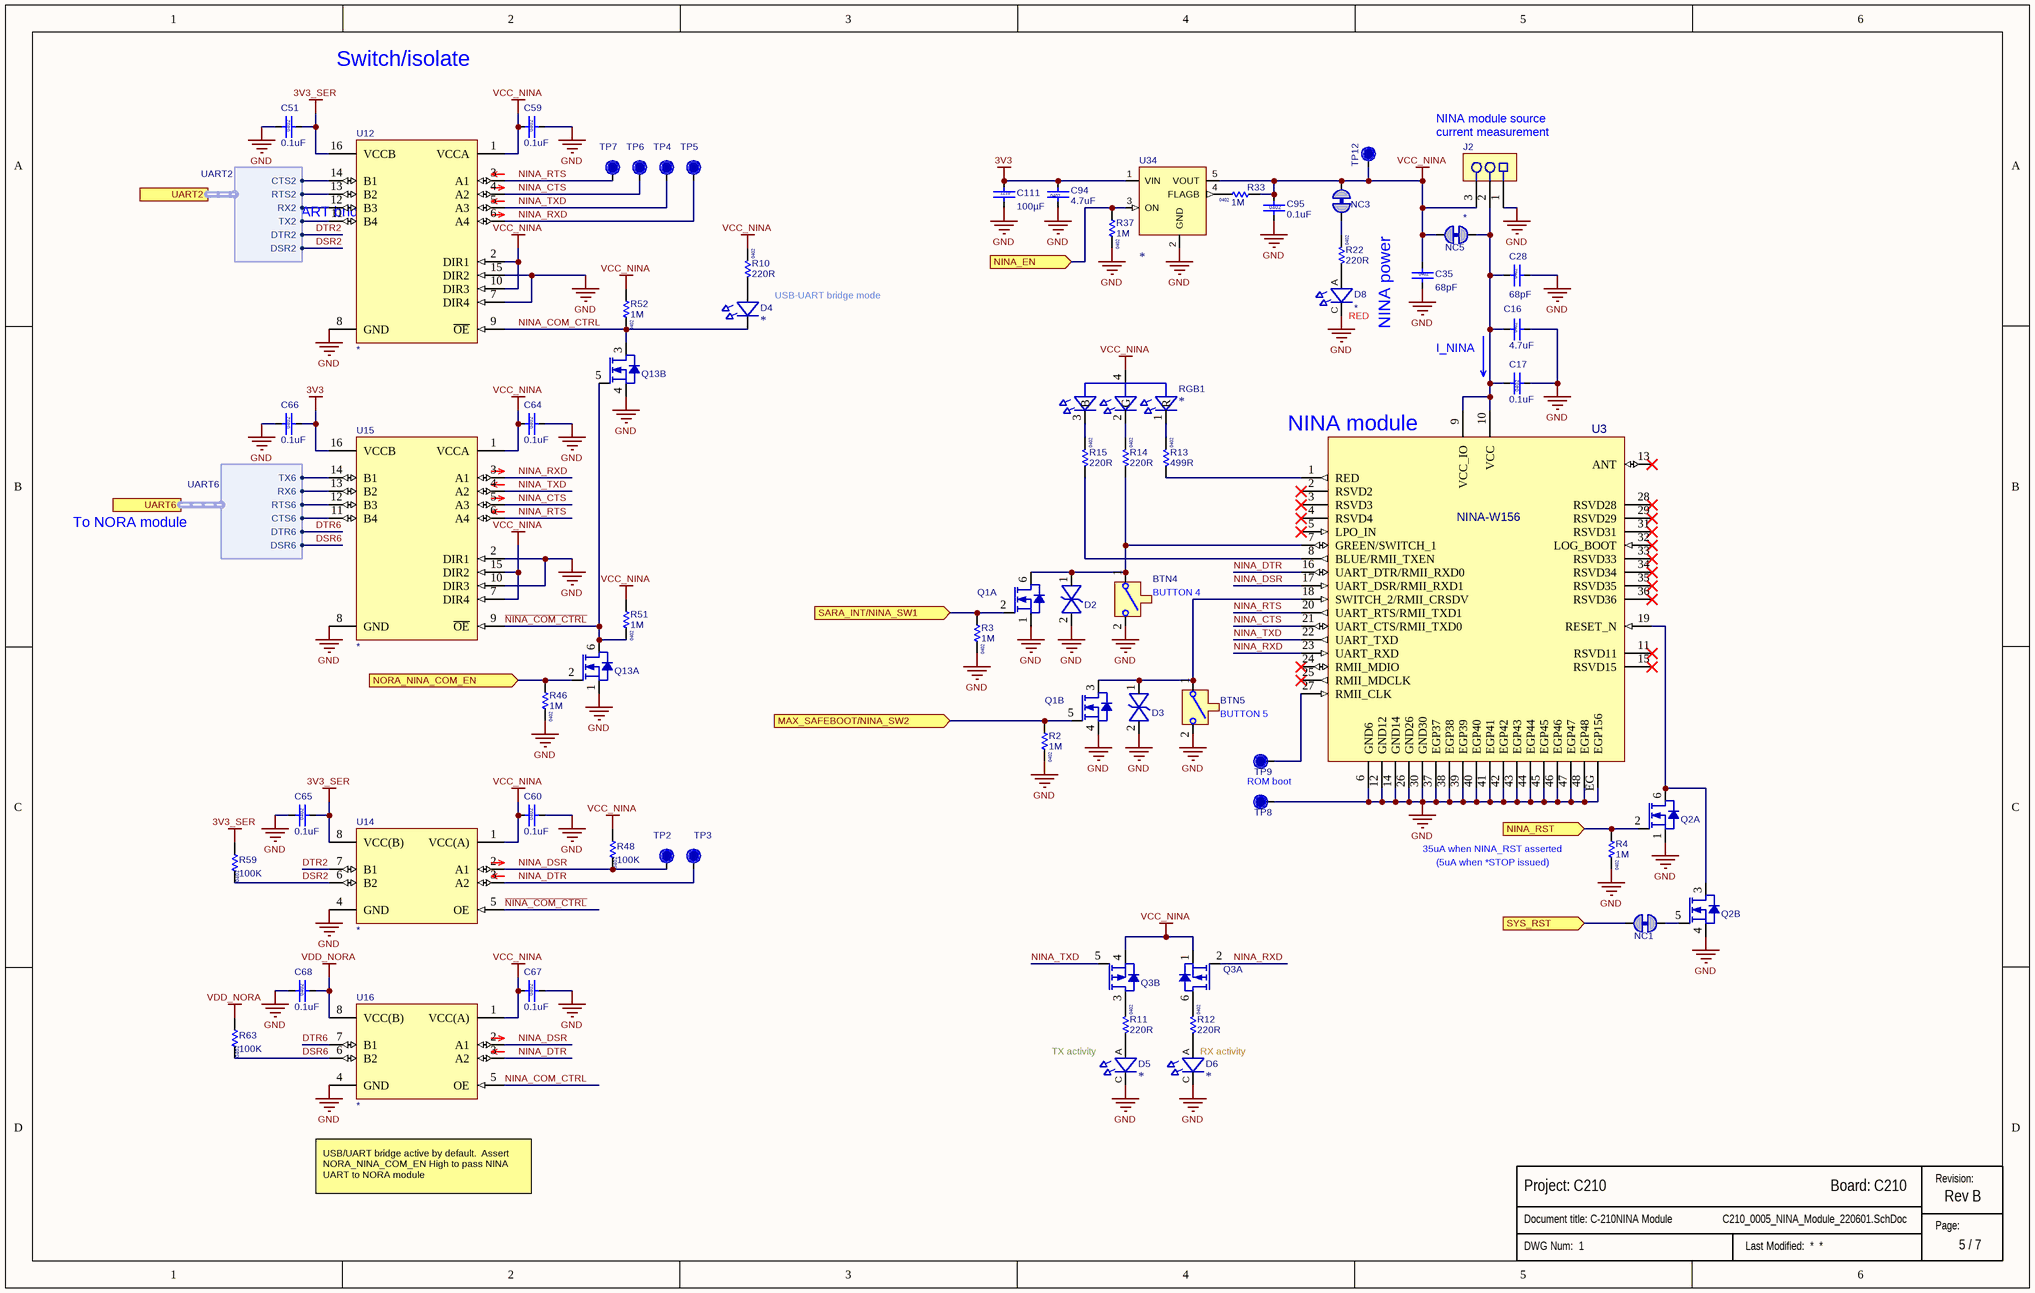
[diagram p7: C210_0005_NINA_Module_220601.SchDoc]

### Parts
(Parts that share a designator on the sheet are numbered #1, #2 ... from top to bottom, then left to right.)
?#9  (no value)  (graphical)
BTN4  (no value)  [B3U-1000P]
BTN5  (no value)  [B3U-1000P]
C16  value 4.7uF  Size: 0402  [Cap 0402 HD]
C17  value 0.1uF  Size: 0402  [Cap 0402 HD]  (hidden comment: 120-000160.1uF)
C28  value 68pF  Size: 0402  [Cap 0402 HD]
C35  value 68pF  Size: 0402  [Cap 0402 HD]
C51  value 0.1uF  Size: 0402  [Cap 0402 HD]  (hidden comment: 120-000160.1uF)
C59  value 0.1uF  Size: 0402  [Cap 0402 HD]  (hidden comment: 120-000160.1uF)
C60  value 0.1uF  Size: 0402  [Cap 0402 HD]  (hidden comment: 120-000160.1uF)
C64  value 0.1uF  Size: 0402  [Cap 0402 HD]  (hidden comment: 120-000160.1uF)
C65  value 0.1uF  Size: 0402  [Cap 0402 HD]  (hidden comment: 120-000160.1uF)
C66  value 0.1uF  Size: 0402  [Cap 0402 HD]  (hidden comment: 120-000160.1uF)
C67  value 0.1uF  Size: 0402  [Cap 0402 HD]  (hidden comment: 120-000160.1uF)
C68  value 0.1uF  Size: 0402  [Cap 0402 HD]  (hidden comment: 120-000160.1uF)
C94  value 4.7uF  Size: 0402  [Cap 0402 HD]
C95  value 0.1uF  Size: 0402  [Cap 0402 HD]  (hidden comment: 120-000160.1uF)
C111  value 100µF  Size: 1210  [Cap 1210]
D2  (no value)  [SOD-523_ALT]
D3  (no value)  [SOD-523_ALT]
D4  (no value)  [LED-0603]
D5  (no value)  [LTST-C190KGKT]
D6  (no value)  [LTST-C190YKT]
D8  (no value)  [LTST-C190EKT]
J2  (no value)  [HDR-0.1P-3Pin-1Row-SMT]
NC1  Solderbridge-ShortDNP  [Solderbridge-Short]  (value not drawn)  (net tie, no BOM)
NC3  Solderbridge-ShortDNP  [Solderbridge-Short]  (value not drawn)  (net tie, no BOM)
NC5  Solderbridge-ShortDNP  [Solderbridge-Short]  (value not drawn)  (net tie, no BOM)
Q1  (no value)  [SOT-563]  (parts A,B of 2)
Q2  (no value)  [SOT-563]  (parts A,B of 2)
Q3  (no value)  [FDY2000PZ]  (parts A,B of 2)
Q13  (no value)  [SOT-563]  (parts A,B of 2)
R2  value 1M  Size: 0402  [RES 0402 HD]
R3  value 1M  Size: 0402  [RES 0402 HD]
R4  value 1M  Size: 0402  [RES 0402 HD]
R10  value 220R  Size: 0402  [RES 0402 HD]
R11  value 220R  Size: 0402  [RES 0402 HD]
R12  value 220R  Size: 0402  [RES 0402 HD]
R13  value 499R  Size: 0402  [RES 0402 HD]
R14  value 220R  Size: 0402  [RES 0402 HD]
R15  value 220R  Size: 0402  [RES 0402 HD]
R22  value 220R  Size: 0402  [RES 0402 HD]
R33  value 1M  Size: 0402  [RES 0402 HD]
R37  value 1M  Size: 0402  [RES 0402 HD]
R46  value 1M  Size: 0402  [RES 0402 HD]
R48  value 100K  Size: 0402  [RES 0402 HD]
R51  value 1M  Size: 0402  [RES 0402 HD]
R52  value 1M  Size: 0402  [RES 0402 HD]
R59  value 100K  Size: 0402  [RES 0402 HD]
R63  value 100K  Size: 0402  [RES 0402 HD]
RGB1  (no value)  [LED_1616]
TP2  TP  [TP12R]  (value not drawn)  (no BOM)
TP3  TP  [TP12R]  (value not drawn)  (no BOM)
TP4  TP  [TP12R]  (value not drawn)  (no BOM)
TP5  TP  [TP12R]  (value not drawn)  (no BOM)
TP6  TP  [TP12R]  (value not drawn)  (no BOM)
TP7  TP  [TP12R]  (value not drawn)  (no BOM)
TP8  TP  [TP12R]  (value not drawn)  (no BOM)
TP9  TP  [TP12R]  (value not drawn)  (no BOM)
TP12  TP  [TP12R]  (value not drawn)  (no BOM)
U3  NINA-W156  [NINA_LGA48R_1400X1000X223_PCB]
U12  (no value)  [QFN0.5P2x6-16Pin_W-Pad]
U14  (no value)  [QFN0.4P3x1-8Pin]
U15  (no value)  [QFN0.5P2x6-16Pin_W-Pad]
U16  (no value)  [QFN0.4P3x1-8Pin]
U34  (no value)  [SOT-23-5_2]

### Ports
MAX_SAFEBOOT/NINA_SW2 (in), NINA_EN (in), NINA_RST (in), NORA_NINA_COM_EN (in), SARA_INT/NINA_SW1 (in), SYS_RST (in), UART2 (harness UART2), UART6 (harness UART6)

### Harnesses
UART6: TX6, RX6, RTS6, CTS6, DTR6, DSR6
UART2: TX2, RX2, RTS2, CTS2, DTR2, DSR2

### Nets
3V3: C66.2 C94.2 C111.1 U15.16(VCCB) U34.1(VIN)
3V3_SER: C51.2 C65.2 R59.1 U12.16(VCCB) U14.8(VCC(B))
GND: BTN4.2 BTN5.2 C16.2 C17.1 C28.2 C35.2 C51.1 C59.2 C60.2 C64.2 C65.1 C66.1 C67.2 C68.1 C94.1 C95.2 C111.2 D2.2 D3.2 D5.C(Cathode) D6.C(Cathode) D8.C(Cathode) J2.1 Q1.1(S1) Q1.4(S2) Q2.1(S1) Q2.4(S2) Q13.1(S1) Q13.4(S2) R2.2 R3.2 R4.2 R37.2 R46.2 TP8.1 U3.6(GND6) U3.12(GND12) U3.14(GND14) U3.26(GND26) U3.30(GND30) U3.37(EGP37) U3.38(EGP38) U3.39(EGP39) U3.40(EGP40) U3.41(EGP41) U3.42(EGP42) U3.43(EGP43) U3.44(EGP44) U3.45(EGP45) U3.46(EGP46) U3.47(EGP47) U3.48(EGP48) U3.EG(EGP156) U12.7(DIR4) U12.8(GND) U12.15(DIR2) U14.4(GND) U15.2(DIR1) U15.8(GND) U15.10(DIR3) U16.4(GND) U34.2(GND)
VCC_NINA: C35.1 C59.1 C60.1 C64.1 C67.1 C95.1 J2.3 NC3.1 NC5.2 Q3.1(S1) Q3.4(S2) R10.2 R33.1 R48.1 R51.1 R52.1 RGB1.4(A) TP12.1 U12.1(VCCA) U12.2(DIR1) U12.10(DIR3) U14.1(VCC(A)) U15.1(VCCA) U15.7(DIR4) U15.15(DIR2) U16.1(VCC(A)) U34.5(VOUT)
VDD_NORA: C68.2 R63.1 U16.8(VCC(B))
CTS6: U15.11(B4) ; port UART6.CTS6
DSR2: R59.2 U14.6(B2) ; port UART2.DSR2
DSR6: R63.2 U16.6(B2) ; port UART6.DSR6
DTR2: U14.7(B1) ; port UART2.DTR2
DTR6: U16.7(B1) ; port UART6.DTR6
~{NINA_COM_CTRL}: Q13.5(G2) Q13.6(D1) R51.2 U14.5(OE) U15.9(~{OE})
NINA_COM_CTRL: D4.1(C) Q13.3(D2) R52.2 U12.9(~{OE}) U16.5(OE)
NINA_CTS: TP6.1 U3.21(UART_CTS/RMII_TXD0) U12.4(A2) U15.5(A3)
NINA_DSR: R48.2 TP2.1 U3.17(UART_DSR/RMII_RXD1) U14.2(A1) U16.2(A1)
NINA_DTR: TP3.1 U3.16(UART_DTR/RMII_RXD0) U14.3(A2) U16.3(A2)
NINA_RTS: TP7.1 U3.20(UART_RTS/RMII_TXD1) U12.3(A1) U15.6(A4)
NINA_RXD: Q3.2(G1) TP5.1 U3.23(UART_RXD) U12.6(A4) U15.3(A1)
NINA_TXD: Q3.5(G2) TP4.1 U3.22(UART_TXD) U12.5(A3) U15.4(A2)
RTS6: U15.12(B3) ; port UART6.RTS6
RX6: U15.13(B2) ; port UART6.RX6
SYS_RST: NC1.2 ; port SYS_RST
TX6: U15.14(B1) ; port UART6.TX6
NetBTN4_1: BTN4.1 D2.1 Q1.6(D1) R14.1 U3.7(GREEN/SWITCH_1)
NetBTN5_1: BTN5.1 D3.1 Q1.3(D2) U3.18(SWITCH_2/RMII_CRSDV)
NetC16_1: C16.1 C17.2 C28.1 J2.2 NC5.1 U3.9(VCC_IO) U3.10(VCC)
NetD4_2: D4.2(A) R10.1
NetD5_A: D5.A(Anode) R11.1
NetD6_A: D6.A(Anode) R12.1
NetD8_A: D8.A(Anode) R22.1
NetNC1_1: NC1.1 Q2.5(G2)
NetNC3_2: NC3.2 R22.2
NetQ1_2: Q1.2(G1) R3.1 ; port SARA_INT/NINA_SW1
NetQ1_5: Q1.5(G2) R2.1 ; port MAX_SAFEBOOT/NINA_SW2
NetQ2_2: Q2.2(G1) R4.1 ; port NINA_RST
NetQ2_3: Q2.3(D2) Q2.6(D1) U3.19(RESET_N)
NetQ3_3: Q3.3(D2) R11.2
NetQ3_6: Q3.6(D1) R12.2
NetQ13_2: Q13.2(G1) R46.1 ; port NORA_NINA_COM_EN
NetR13_1: R13.1 U3.1(RED)
NetR13_2: R13.2 RGB1.1(R)
NetR14_2: R14.2 RGB1.2(G)
NetR15_1: R15.1 U3.8(BLUE/RMII_TXEN)
NetR15_2: R15.2 RGB1.3(B)
NetR33_2: R33.2 U34.4(FLAGB)
NetR37_1: R37.1 U34.3(ON) ; port NINA_EN
NetTP9_1: TP9.1 U3.27(RMII_CLK)
NetU6_13: U12.14(B1) ; port UART2.CTS2
NetU6_14: U12.13(B2) ; port UART2.RTS2
NetU6_15: U12.12(B3) ; port UART2.RX2
NetU6_16: U12.11(B4) ; port UART2.TX2

Not connected (* = marked no-connect by the designer): U3 2(RSVD2)* 3(RSVD3)* 4(RSVD4)* 5(LPO_IN)* 11(RSVD11)* 13(ANT)* 15(RSVD15)* 24(RMII_MDIO)* 25(RMII_MDCLK)* 28(RSVD28)* 29(RSVD29)* 31(RSVD31)* 32(LOG_BOOT)* 33(RSVD33)* 34(RSVD34)* 35(RSVD35)* 36(RSVD36)*

### Notes on the sheet
- Switch/isolate
- NINA module source
- (near J2) current measurement
- To USB-UART bridge
- USB-UART bridge mode
- (near D8) RED
- NINA power
- I_NINA
- (near U3) NINA module
- To NORA module
- (near BTN4) BUTTON 4
- BUTTON 5
- ROM boot
- 35uA when NINA_RST asserted
- (5uA when *STOP issued)
- TX activity
- (near D6) RX activity
- USB/UART bridge active by default.  Assert NORA_NINA_COM_EN High to pass NINA UART to NORA module
- Revision:
- Page:

### Library data of the parts
?#9 = Sub_Title_Block: as ?#6 on sheet C210_0007_Sensors_220601
BTN4 BTN5 = 135-00007: Button, Momentary SPST-NO, 0.05A, 12V, 3mm x 2.5mm; Manufacturer 1: Omron Electronics Inc-EMC Div; Part Name: SWITCH TACTILE SPST-NO 0.05A 12V; Current: 50mA; Item Phase: In Production; Use in new designs: Yes; Voltage: 12VDC; UBX Code: None; Part Number: 135-00007; Manufacturer Part Number 1: B3U-1000P; Supplier 1: Digi-Key; Supplier Part Number 1: SW1020CT-ND; Body Size: 3mm x 2.5mm; Height: 1.2mm; Max Operating Temp: 70; Min Operating Temp: -25; Pins: 2; Revision: 0A; Manufacturer 2: None; Manufacturer Part Number 2: None; Supplier 2: None; Supplier Part Number 2: None
C16 C94 = 120-00020: as C109 on sheet C210_0007_Sensors_220601; Part Number: 120-00020; Supplier 1: Digi-Key; Supplier Part Number 1: 1276-1482-1-ND; Manufacturer 2: Yageo; Manufacturer Part Number 2: CC0402KRX5R6BB475; Supplier 2: Digi-Key; Supplier Part Number 2: 311-3477-1-ND; Height: 0.55mm; Max Operating Temp: 85; Min Operating Temp: -55; Pins: 2; Revision: 0C; Temperature Coefficient: X5R; Voltage: 10V
C17 C51 C59 C60 C64-C68 C95 = 120-00016: as C71 on sheet C210_0007_Sensors_220601; Part Number: 120-00016; Revision: 0A; Supplier 1: Digi-Key; Supplier Part Number 1: 490-6297-1-ND; Manufacturer 2: Yageo; Manufacturer P/N 2: CC0402KRX5R6BB104; Supplier 2: Digi-Key; Supplier Part Number 2: 311-1336-1-ND; Arena Link: https://app.bom.com/a/GYHPV2L2L43KRMBK?v=spec.summary; Height: 0.55mm; Pins: 2; Temperature Coefficient: X5R; Voltage: 10V
C28 C35 = 120-00047: as C138-C140 on sheet C210_0007_Sensors_220601; Part Number: 120-00047; Supplier 1: Digi-Key; Supplier Part Number 1: 490-8219-1-ND; Manufacturer 2: AVX Corporation; Manufacturer Part Number 2: 04025A680FAT2A; Supplier 2: Digi-Key; Supplier Part Number 2: 478-7881-1-ND; Height: 0.55mm; Max Operating Temp: 125; Min Operating Temp: -55; Pins: 2; Revision: None; Temperature Coefficient: NP0; Voltage: 50V
C111 = 120-00223: 100µF ±20% 10V Ceramic Capacitor X5R 1210 (3225 Metric); Manufacturer 1: Samsung Electro-Mechanics America, Inc.; Manufacturer Part Number 1: CL32A107MPVNNNE; Part Name: CAP CER 100UF 10V 20% X5R 1210; Item Phase: In Production; Tolerance: +/- 20%; Use in new designs: Yes; UBX Code: None; Part Number: 120-00223; Supplier 1: Future Electronics; Supplier Part Number 1: Samsung Electro-Mechanics America, Inc. CL32A107MPVNNNE; Manufacturer 2: None; Manufacturer Part Number 2: None; Supplier 2: None; Supplier Part Number 2: None; Height: 2.8mm; Max Operating Temp: 85; Min Operating Temp: -55; Pins: 2; Revision: 0A; Temperature Coefficient: X5R; Voltage: 10V
D2 D3 = 110-00041: Diode TVS 5VWM BiDIR SOD523; Manufacturer 1: ON Semiconductor; Manufacturer Part Number 1: ESD5B5.0ST1G; Part Name: Diode TVS 5VWM SOD523; Body Size: 1.2mm x 0.8mm; Current: None; Item Phase: Unreleased; MFG Package: SOD-523; Use in new designs: Yes; Part Number: 110-00041; Supplier 1: Digi-Key; Supplier Part Number 1: ESD5B5.0ST1GOSCT-ND; Manufacturer 2: None; Manufacturer Part Number 2: None; Supplier 2: None; Supplier Part Number 2: None; Height: 0.7mm; Max Operating Temp: 150; Min Operating Temp: -55; Pins: 2; Revision: None; Voltage: 5VWM; UBX Code: None
D4 = 115-00023: as D15 on sheet C210_0004_MAX_Module_220601; Color: *; Part Number: 115-00023; Supplier 1: Digi-Key; Supplier Part Number 1: 475-2816-1-ND; Current: None; Height: None; MFG Package: None; Max Operating Temp: None; Min Operating Temp: None; Part Name: LED BLUE DIFFUSED 0603 SMD; Pins: None; Revision: None; Size: None; Use in new designs: None; Voltage: None; UBX Code: None; Manufacturer 2: None; Manufacturer Part Number 2: None; Supplier 2: None; Supplier Part Number 2: None
D5 = LTST-C190KGKT: as D16 on sheet C210_0004_MAX_Module_220601; Manufacturer Part Number 1: LTST-C190KGKT; Supplier 1: Digi-Key; Supplier Part Number 1: 160-1435-2-ND; Current: 20mA; Height: 0.80mm; Max Operating Temp: 85; Min Operating Temp: -30; Pins: 2; Revision: 0A; Size: 0603; Voltage: 2.0V; UBX Code: None; Manufacturer 2: None; Manufacturer Part Number 2: None; Supplier 2: None; Supplier Part Number 2: None; Color: *
D6 = LTST-C190YKT: as D17 on sheet C210_0004_MAX_Module_220601; Part Number: LTST-C190YKT; Manufacturer Part Number 1: LTST-C190YKT; Supplier 1: Digi-Key; Supplier Part Number 1: 160-1184-2-ND; Current: 10mA; Height: 0.80mm; Max Operating Temp: 85; Min Operating Temp: -30; Pins: 2; Revision: 0A; Size: 0603; Voltage: 2.1V; UBX Code: None; Manufacturer 2: None; Manufacturer Part Number 2: None; Supplier 2: None; Supplier Part Number 2: None; Color: *
D8 = LTST-C190EKT: as D21 on sheet C210_0004_MAX_Module_220601; Part Number: LTST-C190EKT; Manufacturer Part Number 1: LTST-C190EKT; Supplier 1: Digi-Key; Supplier Part Number 1: 160-1182-2-ND; Current: 10mA; Height: 0.80mm; Max Operating Temp: 85; Min Operating Temp: -30; Pins: 2; Revision: 0A; Size: 0603; Voltage: 2.0V; UBX Code: None; Manufacturer 2: None; Manufacturer Part Number 2: None; Supplier 2: None; Supplier Part Number 2: None; Color: *
J2 = 130-00105: as J6 on sheet C210_0004_MAX_Module_220601; Manufacturer P/N: *; Part Number: 130-00105; Supplier 1: Digi-Key; Supplier Part Number 1: 952-1951-ND; Diameter: None; Height: 9.93mm; Max Operating Temp: None; Min Operating Temp: None; Pins: 3; Revision: 0C; UBX Code: None; Manufacturer 2: Greenconn Corporation; Manufacturer Part Number 2: GPHC1010302A081B1BD; Supplier 2: Teamwise Limited; Supplier Part Number 2: Greenconn Corporation GPHC1010302A081B1BD
NC1 NC3 NC5 = Solderbridge-Short: Added By: Paul B; Part Number: Solderbridge-Short; Height: 0; DNP: DNP; Added Date: 12/2/2015
Q1 Q2 Q13 = 140-00016: as Q14 on sheet C210_0001_Serial_Interface_220601; Part Number: 140-00016; Supplier 1: Digi-Key; Supplier Part Number 1: SSM6N56FELMCT-ND; Height: 0.6mm; MFG Package: SOT-563; Max Operating Temp: 150; Min Operating Temp: -55; Pins: 6; Revision: 0A; Voltage: 20V; Manufacturer 2: None; Manufacturer Part Number 2: None; Supplier 2: None; Supplier Part Number 2: None
Q3 = FDY2000PZ: as Q20 on sheet C210_0004_MAX_Module_220601; Part Number: FDY2000PZ; Manufacturer Part Number 1: FDY2000PZ; Supplier 1: Digi-Key; Supplier Part Number 1: 2156-FDY2000PZ-ND; Current: -350mA; Height: 0.6mm; MFG Package: SOT-563; Max Operating Temp: 150; Min Operating Temp: -55; Part Name: MOSFET DUAL P-CH 20V SOT-563; Pins: 6; Revision: 0A; Voltage: 20V; Manufacturer 2: None; Manufacturer Part Number 2: None; Supplier 2: None; Supplier Part Number 2: None
R2-R4 R33 R37 R46 R51 R52 = 180-00054: as R90 on sheet C210_0001_Serial_Interface_220601; Part Number: 180-00054; Supplier 1: Digi-Key; Supplier Part Number 1: 1276-3433-1-ND; Manufacturer 2: Hong Kong Resistors Manufactory; Manufacturer Part Number 2: RCT021MFLF; Supplier 2: None; Supplier Part Number 2: None; Height: 0.4mm; Max Operating Temp: 155; Min Operating Temp: -55; Pins: 2; Power: 1/16W; Revision: 0D; UBX Code: None
R10-R12 R14 R15 R22 = 180-00098: as R68 on sheet C210_0004_MAX_Module_220601; Part Number: 180-00098; Part_Type: Resistor; Supplier 1: Digi-Key; Supplier Part Number 1: P220JCT-ND; Arena Link: https://app.bom.com/a/8Q9HNUDUDWVBJC30?v=spec.summary; Pins: 2; Power: 1/16W; Revision: 0C; Manufacturer 2: Samsung Electro-Mechanics America, Inc; Manufacturer P/N 2: RC1005J221CS; Supplier 2: Digi-Key; Supplier Part Number 2: 1276-4360-1-ND; Alternate Footprint Ref: RES 0402; Height: 0.4mm
R13 = 180-00031: Resistor, 499ohm, 1%, 1/16W, 0402; Part Name: RES SMD 499 OHM 1% 1/16W 0402; Manufacturer: Rohm Semiconductor; Manufacturer P/N: MCR01MRTF4990; Item_Phase: Production; Component Mounting Type: SMT; Tolerance: +/- 1%; Use in new designs: Yes; Part Number: 180-00031; Part_Type: Resistor; Supplier 1: Digi-Key; Supplier Part Number 1: RHM499CDCT-ND; Manufacturer 2: Samsung Electro-Mechanics America, Inc; Manufacturer P/N 2: RC1005F4990CS; Arena Link: https://app.bom.com/a/Q8RZ5CVCVEDU1SS5?v=spec.summary; Height: 0.4mm; Pins: 2; Power: 1/16W; Revision: 0D; Supplier 2: Digi-Key; Supplier Part Number 2: 1276-3992-1-ND; Alternate Footprint Ref: RES 0402
R48 R59 R63 = 180-00093: as R57 on sheet C210_0007_Sensors_220601; Part Number: 180-00093; Supplier 1: Digi-Key; Supplier Part Number 1: 311-100KLRCT-ND; Manufacturer 2: Rohm Semiconductor; Manufacturer Part Number 2: MCR01MRTF1003; Supplier 2: Digi-Key; Supplier Part Number 2: RHM100KCDCT-ND; Height: 0.4mm; Max Operating Temp: 155; Min Operating Temp: -55; Pins: 2; Power: 1/16W; Revision: 0B; UBX Code: None
RGB1 = 115-00026: LED RGB SMT 0606; Manufacturer 1: Lite-On Inc; Manufacturer Part Number 1: LTST-C19HE1WT; Body Size: 1.6mm x 1.6mm; Current: 20mA; Item Phase: In Production; MFG Package: 0606; Use in new designs: Yes; Voltage: None; Color: *; Part Number: 115-00026; Supplier 1: Digi-Key; Supplier Part Number 1: 160-2162-1-ND; Height: 0.35mm; Max Operating Temp: 80; Min Operating Temp: -20; Part Name: LED RGB SMT 0606; Pins: 4; Revision: 0B; Size: Other; UBX Code: None; Manufacturer 2: QT Brightek (QTB); Manufacturer Part Number 2: QBLP600-RGB; Supplier 2: Digi-Key; Supplier Part Number 2: 1516-1184-1-ND
TP2-TP9 TP12 = TP_R: as TP32 on sheet C210_0007_Sensors_220601; Size: 1.0mm; Height: 0; DNP: DNP; Added Date: 2/1/2015; Checked By: Paul B; Checked Date: 2/5/2015
U3 = NINA-W156: u-blox NINA-W156 WiFi, Bluetooth dual-mode module; Part Description: Stand-alone Bluetooth low energy module; Manufacturer: u-blox; Value: NINA-W156
U12 U15 = 225-00011: Voltage Level Translator Bidirectional 1 Circuit 4 Channel 380Mbps 16-DHVQFN (2.5x3.5); Manufacturer 1: NXP Semiconductors; Manufacturer Part Number 1: 74AVC4TD245BQ,115; Part Name: TXRX XLATING BIDIR 4CH 16-DHVQFN; Body Size: 2.5mm x 3.5mm; Item Phase: In Production; SMT Pitch: 0.5mm; Thermal Pad: Yes; Voltage: 3.6V; UBX Code: None; Manufacturer P/N: *; Part Number: 225-00011; Supplier 1: Digi-Key; Supplier Part Number 1: 568-9220-1-ND; Height: 1mm; Logic Type: Level Translator; MFG Package: 16-DHVQFN; Max Operating Temp: 125; Min Operating Temp: -40; Pins: 16; Revision: 0B; Use in new designs: Yes; Manufacturer 2: ON Semiconductor; Manufacturer Part Number 2: FXL4TD245BQX; Supplier 2: Digi-Key; Supplier Part Number 2: FXL4TD245BQXCT-ND
U14 U16 = 225-00008: as U19 on sheet C210_0004_MAX_Module_220601; Manufacturer P/N: *; Part Number: 225-00008; Manufacturer Part Number 1: NTSX2102GU8H; Supplier 1: Digi-Key; Supplier Part Number 1: 568-10216-2-ND; Height: 0.5mm; Max Operating Temp: 85; Min Operating Temp: -40; Pins: 8; Revision: 0A; Manufacturer 2: None; Manufacturer Part Number 2: None; Supplier 2: None; Supplier Part Number 2: None
U34 = FPF2104: Load Switch, 400mA, 1.8-5.5V, Active High Enable, SOT-23-5; Manufacturer 1: onsemi; Current: None; Item Phase: In Production; Use in new designs: Yes; Voltage: 5.5V; Manufacturer Part Number 1: FPF2104; Manufacturer 2: None; Manufacturer Part Number 2: None; Supplier 2: None; Supplier Part Number 2: None; Body Size: SOT-23-5; Height: 1.2mm; MFG Package: SOT-23-5; Max Operating Temp: 85; Min Operating Temp: -40; Pins: 5; Revision: 0A; UBX Code: None; Manufacturer P/N: *